# EAGLE design busdings (EAGLE 5.11)
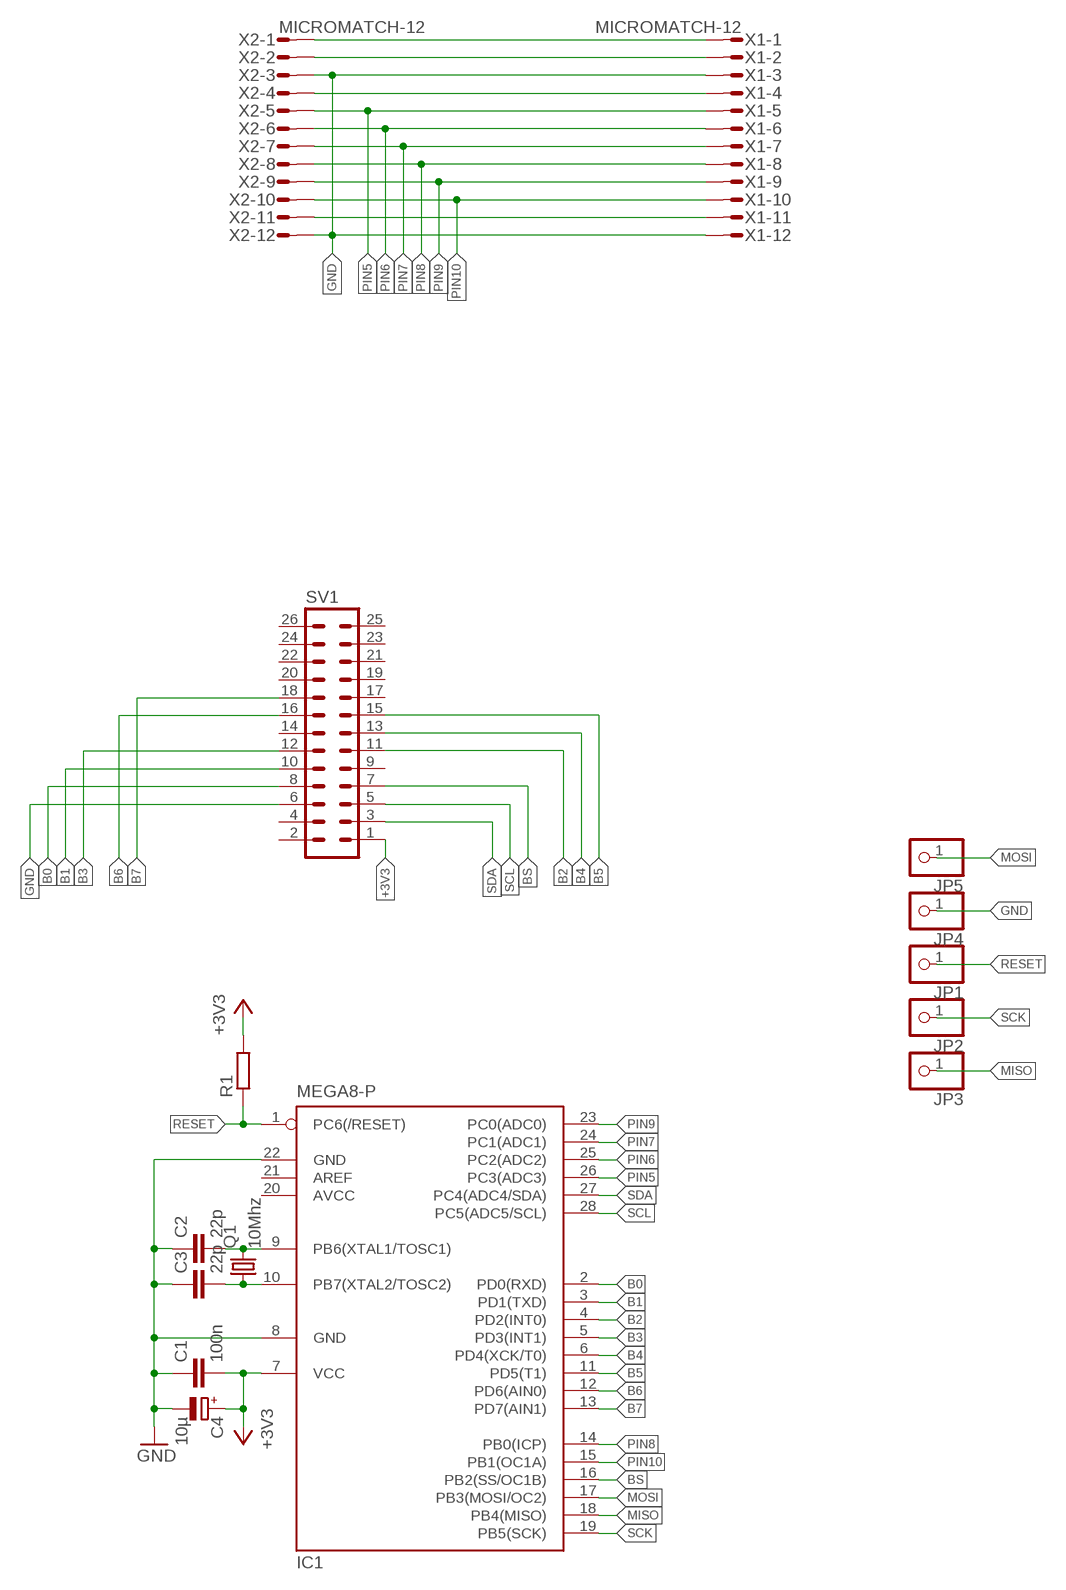
[diagram p0: schematic, sheet 1]

## Parts
C1  100n  C-EU025-040X050  [C025-040X050]
C2  22p  C-EU025-030X050  [C025-030X050]
C3  22p  C-EU025-030X050  [C025-030X050]
C4  10µ  CPOL-EUE2.5-6  [E2,5-6]
IC1  MEGA8-P  [DIL28-3]
JP1  PINHD-1X1  [1X01]
JP2  PINHD-1X1  [1X01]
JP3  PINHD-1X1  [1X01]
JP4  PINHD-1X1  [1X01]
JP5  PINHD-1X1  [1X01]
Q1  10Mhz  CRYSTALHC49S  [HC49/S]
R1  R-EU_0207/10  [0207/10]
SV1  ML26  [ML26]
X1  MICROMATCH-12  [MICROMATCH-12]
X2  MICROMATCH-12  [MICROMATCH-12]

## Nets
+3V3: C1.2 C4.+ IC1.7(VCC) R1.2
B0: IC1.2(PD0(RXD)) SV1.8
B1: IC1.3(PD1(TXD)) SV1.10
B2: IC1.4(PD2(INT0)) SV1.11
B3: IC1.5(PD3(INT1)) SV1.12
B4: IC1.6(PD4(XCK/T0)) SV1.13
B5: IC1.11(PD5(T1)) SV1.15
B6: IC1.12(PD6(AIN0)) SV1.16
B7: IC1.13(PD7(AIN1)) SV1.18
BS: IC1.16(PB2(SS/OC1B)) SV1.7
GND: C1.1 C2.1 C3.1 C4.- IC1.8(GND) IC1.22(GND) JP4.1 SV1.6 X1.3 X1.12 X2.3 X2.12
MISO: IC1.18(PB4(MISO)) JP3.1
MOSI: IC1.17(PB3(MOSI/OC2)) JP5.1
N$27: X1.1 X2.1
N$28: X1.2 X2.2
N$30: X1.4 X2.4
N$31: X1.11 X2.11
N$46: C2.2 IC1.9(PB6(XTAL1/TOSC1)) Q1.2
N$47: C3.2 IC1.10(PB7(XTAL2/TOSC2)) Q1.1
PIN5: IC1.26(PC3(ADC3)) X1.5 X2.5
PIN6: IC1.25(PC2(ADC2)) X1.6 X2.6
PIN7: IC1.24(PC1(ADC1)) X1.7 X2.7
PIN8: IC1.14(PB0(ICP)) X1.8 X2.8
PIN9: IC1.23(PC0(ADC0)) X1.9 X2.9
PIN10: IC1.15(PB1(OC1A)) X1.10 X2.10
RESET: IC1.1(PC6(/RESET)) JP1.1 R1.1
SCK: IC1.19(PB5(SCK)) JP2.1
SCL: IC1.28(PC5(ADC5/SCL)) SV1.5
SDA: IC1.27(PC4(ADC4/SDA)) SV1.3
Unconnected: IC1.21(AREF) SV1.1 SV1.2 SV1.4 SV1.9 SV1.14 SV1.17 SV1.19 SV1.20 SV1.21 SV1.22 SV1.23 SV1.24 SV1.25 SV1.26

## Power pins joined to a net without a drawn wire
AVCC: IC1.20(AVCC)

## Library data of the parts
C1-C3 = rcl:C-EU: CAPACITOR, European symbol
C4 = rcl:CPOL-EU: POLARIZED CAPACITOR, European symbol
IC1 = atmel:MEGA8-P: MICROCONTROLLER 8 Kbytes FLASH, 1 kbytes SRAM, 512 bytes EEPROM, USART, 4-channel 10 bit ADC, 2-channel 8 bit ADC Pin compatible with Atmega48, ATMega88, ATMega168 Source: avr.lbr; OC_FARNELL: unknown; OC_NEWARK: unknown
JP1-JP5 = pinhead:PINHD-1X1: PIN HEADER
Q1 = crystal:CRYSTAL: CRYSTAL; OC_FARNELL: 1667008; OC_NEWARK: unknown
R1 = rcl:R-EU_: RESISTOR, European symbol
SV1 = con-ml:ML26: HARTING; OC_FARNELL: unknown; OC_NEWARK: unknown
X1 X2 = con-amp-micromatch:MICROMATCH-12: MicroMaTch 12 8-215464-2 / 1-215464-2 Drawing Number C-215464 DDEController.pdf; MF: FARNELL; MPN: 8-215464-2; OC_FARNELL: 3784666; OC_NEWARK: 95H9857

## Board
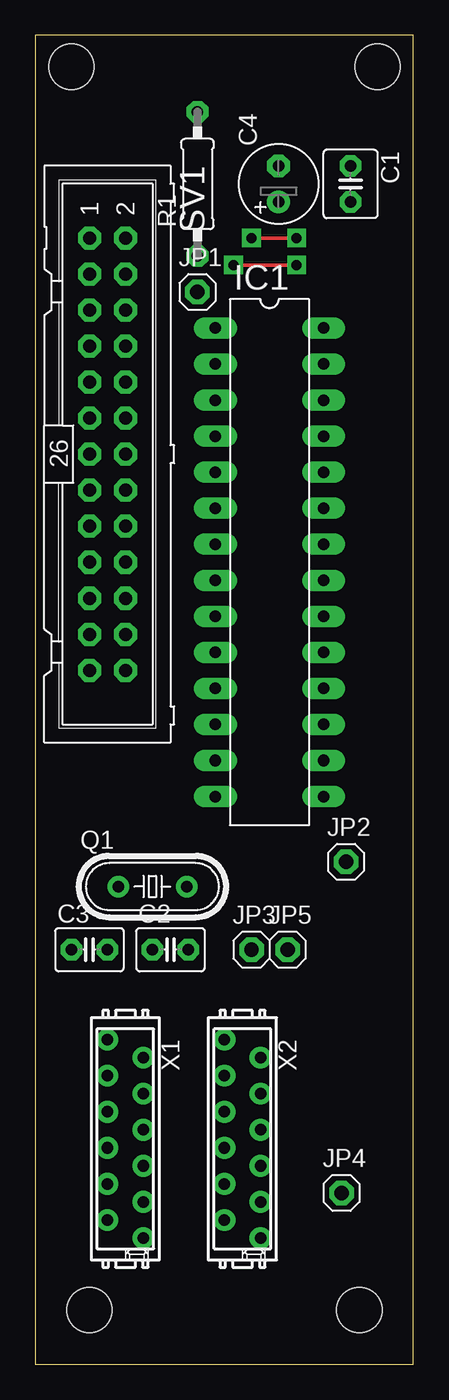
[diagram p1: board, top side]
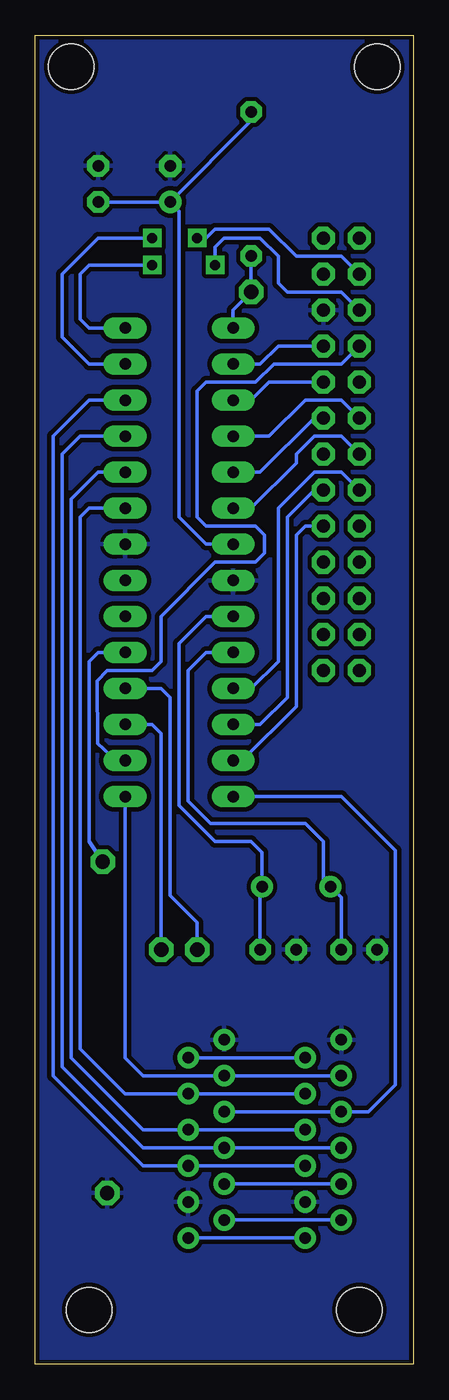
[diagram p2: board, bottom side, seen from below]

Size 26.65 x 93.65 mm. Coordinates in mm from the lower left corner, seen from the top.
Outline: 0,0 26.65,0 26.65,93.65 0,93.65 0,0
Copper layers (1*16): Top 0.035mm / dielectric 1.5mm / Bottom 0.035mm
Design rules "default *": minimum track width 10mil, minimum drill 24mil, track to track 12mil, track to pad 12mil, pad to pad 12mil, via to via 12mil, smd to smd 8mil, copper to edge 10mil, drill to drill 8mil, minimum pad ring 14mil, minimum via ring 12mil, stop-mask expansion 4mil, vias tented up to drill 0mil, thermal gap 10mil
Holes 3.2 mm at 3.81,3.81 22.86,3.81 2.54,91.44 24.13,91.44

### Footprints (pad centres in the part's own frame; a part is rotated, then mirrored left to right if it is on the bottom)
C025-040X050 = drill 0.813 octagon: 1 -1.27,0; 2 1.27,0
C025-030X050 = drill 0.813 octagon: 1 -1.27,0; 2 1.27,0
E2,5-6 = drill 0.813 pad 1.6 round: + -1.27,0 | drill 0.813 pad 1.6 octagon: - 1.27,0
DIL28-3 = drill 0.813 long: 1 -16.51,-3.81; 2 -13.97,-3.81; 3 -11.43,-3.81; 4 -8.89,-3.81; 5 -6.35,-3.81; 6 -3.81,-3.81; 7 -1.27,-3.81; 8 1.27,-3.81; 9 3.81,-3.81; 10 6.35,-3.81; 11 8.89,-3.81; 12 11.43,-3.81; 13 13.97,-3.81; 14 16.51,-3.81; 15 16.51,3.81; 16 13.97,3.81; 17 11.43,3.81; 18 8.89,3.81; 19 6.35,3.81; 20 3.81,3.81; 21 1.27,3.81; 22 -1.27,3.81; 23 -3.81,3.81; 24 -6.35,3.81; 25 -8.89,3.81; 26 -11.43,3.81; 27 -13.97,3.81; 28 -16.51,3.81
1X01 = drill 1.016 octagon: 1 0,0
HC49/S = drill 0.813 round: 1 -2.413,0; 2 2.413,0
0207/10 = drill 0.813 octagon: 1 -5.08,0; 2 5.08,0
ML26 = drill 0.914 octagon: 1 -15.24,-1.27; 2 -15.24,1.27; 3 -12.7,-1.27; 4 -12.7,1.27; 5 -10.16,-1.27; 6 -10.16,1.27; 7 -7.62,-1.27; 8 -7.62,1.27; 9 -5.08,-1.27; 10 -5.08,1.27; 11 -2.54,-1.27; 12 -2.54,1.27; 13 0,-1.27; 14 0,1.27; 15 2.54,-1.27; 16 2.54,1.27; 17 5.08,-1.27; 18 5.08,1.27; 19 7.62,-1.27; 20 7.62,1.27; 21 10.16,-1.27; 22 10.16,1.27; 23 12.7,-1.27; 24 12.7,1.27; 25 15.24,-1.27; 26 15.24,1.27
MICROMATCH-12 = drill 0.813 round: 1 6.985,1.27; 2 5.715,-1.27; 3 4.445,1.27; 4 3.175,-1.27; 5 1.905,1.27; 6 0.635,-1.27; 7 -0.635,1.27; 8 -1.905,-1.27; 9 -3.175,1.27; 10 -4.445,-1.27; 11 -5.715,1.27; 12 -6.985,-1.27

### Placement (x,y rotation side)
C1  22.23,83.19 270 top
C2  9.53,29.21 0 top
C3  3.81,29.21 0 top
C4  17.14,83.19 90 top
IC1  16.51,56.52 270 top
JP1  11.43,75.56 0 top
JP2  21.91,35.4 0 top
JP3  15.24,29.21 0 top
JP4  21.59,12.06 0 top
JP5  17.78,29.21 0 top
Q1  8.26,33.66 0 top
R1  11.43,83.19 90 top
SV1  5.08,64.14 270 top
X1  6.35,15.88 270 top
X2  14.61,15.88 270 top

### Tracks (layer width: path | path; a pad name or v marks a point on that pad's centre or on a via)
+3V3
  Bottom 0.254: C4.+ C1.2 | R1.2 11.43,87.63 C4.+ | IC1.7 14.61,57.78 16.51,59.69 16.51,81.28 C4.+
B0
  Bottom 0.254: SV1.8 9.53,71.75 10.79,70.48 IC1.2
B1
  Bottom 0.254: SV1.10 10.16,69.22 11.43,67.94 IC1.3
B2
  Bottom 0.254: IC1.4 10.16,65.41 7.62,67.94 5.08,67.94 SV1.11
B3
  Bottom 0.254: SV1.12 6.99,66.67 10.79,62.87 IC1.5
B4
  Bottom 0.254: IC1.6 11.43,60.33 8.26,63.5 8.26,64.14 6.99,65.41 5.08,65.41 SV1.13
B5
  Bottom 0.254: SV1.15 5.08,62.87 6.99,62.87 9.53,60.33 9.53,49.53 11.43,47.62 IC1.11
B6
  Bottom 0.254: SV1.16 6.99,61.59 8.89,59.69 8.89,46.99 10.79,45.09 IC1.12
B7
  Bottom 0.254: IC1.13 12.06,42.55 8.26,46.35 8.26,58.42 7.62,59.05 SV1.18
BS
  Bottom 0.254: SV1.7 5.08,70.48 9.84,70.48 11.11,69.22 14.61,69.22 15.24,68.58 15.24,59.69 14.61,59.05 11.11,59.05 10.48,58.42 10.48,57.15 11.11,56.52 13.97,56.52 17.78,52.7 17.78,49.53 18.41,48.9 21.59,48.9 22.28,48.15 22.28,43.76 20.95,42.55 IC1.16
GND
  pour Bottom (isolate 0.3): 0,93.98 26.67,93.98 26.67,0 0,0
MISO
  Bottom 0.254: IC1.18 17.78,47.62 17.14,46.99 17.14,33.02 15.24,31.11 JP3.1
MOSI
  Bottom 0.254: IC1.17 18.41,45.09 17.78,44.45 JP5.1
N$27
  Bottom 0.254: X1.1 X2.1
N$28
  Bottom 0.254: X1.2 X2.2
N$30
  Bottom 0.254: X1.4 X2.4
N$31
  Bottom 0.254: X1.11 X2.11
N$46
  Bottom 0.254: IC1.9 14.61,52.7 16.51,50.8 16.51,39.37 13.97,36.83 11.43,36.83 10.67,36.07 Q1.2 10.79,33.53 C2.2
N$47
  Bottom 0.254: IC1.10 14.61,50.16 15.88,48.9 15.88,39.69 14.29,38.1 7.62,38.1 6.35,36.83 6.35,34.16 Q1.1 5.08,32.89 C3.2
PIN5
  Bottom 0.254: IC1.26 22.86,67.94 25.4,65.41 25.4,20.32 19.05,13.97 X2.5 X1.5
PIN6
  Bottom 0.254: IC1.25 23.5,65.41 24.77,64.14 24.77,20.95 19.05,15.24 X2.6 X1.6
PIN7
  Bottom 0.254: IC1.24 22.23,62.87 24.13,60.96 24.13,21.59 19.05,16.51 X2.7 X1.7
PIN8
  Bottom 0.254: IC1.14 5.08,40.01 1.27,36.2 1.27,19.68 3.17,17.78 X1.8 X2.8
PIN9
  Bottom 0.254: IC1.23 22.86,60.33 23.5,59.69 23.5,22.23 20.32,19.05 X2.9 X1.9
PIN10
  Bottom 0.254: IC1.15 20.32,21.59 19.05,20.32 X2.10 X1.10
RESET
  Bottom 0.254: IC1.1 12.7,74.3 JP1.1 R1.1
SCK
  Bottom 0.254: IC1.19 22.23,50.16 22.86,49.53 22.86,36.83 JP2.1
SCL  (via drill 0.7)
  Top 0.254: v13.97,77.47 v18.41,77.47
  Bottom 0.254: SV1.5 5.08,75.56 8.89,75.56 9.53,76.2 9.53,78.11 10.79,79.38 13.34,79.38 13.97,78.74 v13.97,77.47 | v18.41,77.47 22.86,77.47 23.5,76.83 23.5,73.66 22.86,73.03 IC1.28
SDA  (via drill 0.7)
  Top 0.254: v15.24,79.38 v18.41,79.38
  Bottom 0.254: SV1.3 5.08,78.11 8.26,78.11 10.16,80.01 13.97,80.01 14.61,79.38 v15.24,79.38 | v18.41,79.38 22.23,79.38 24.77,76.83 24.77,72.39 22.86,70.48 IC1.27